# Altium project MedusaTester.PrjPcb
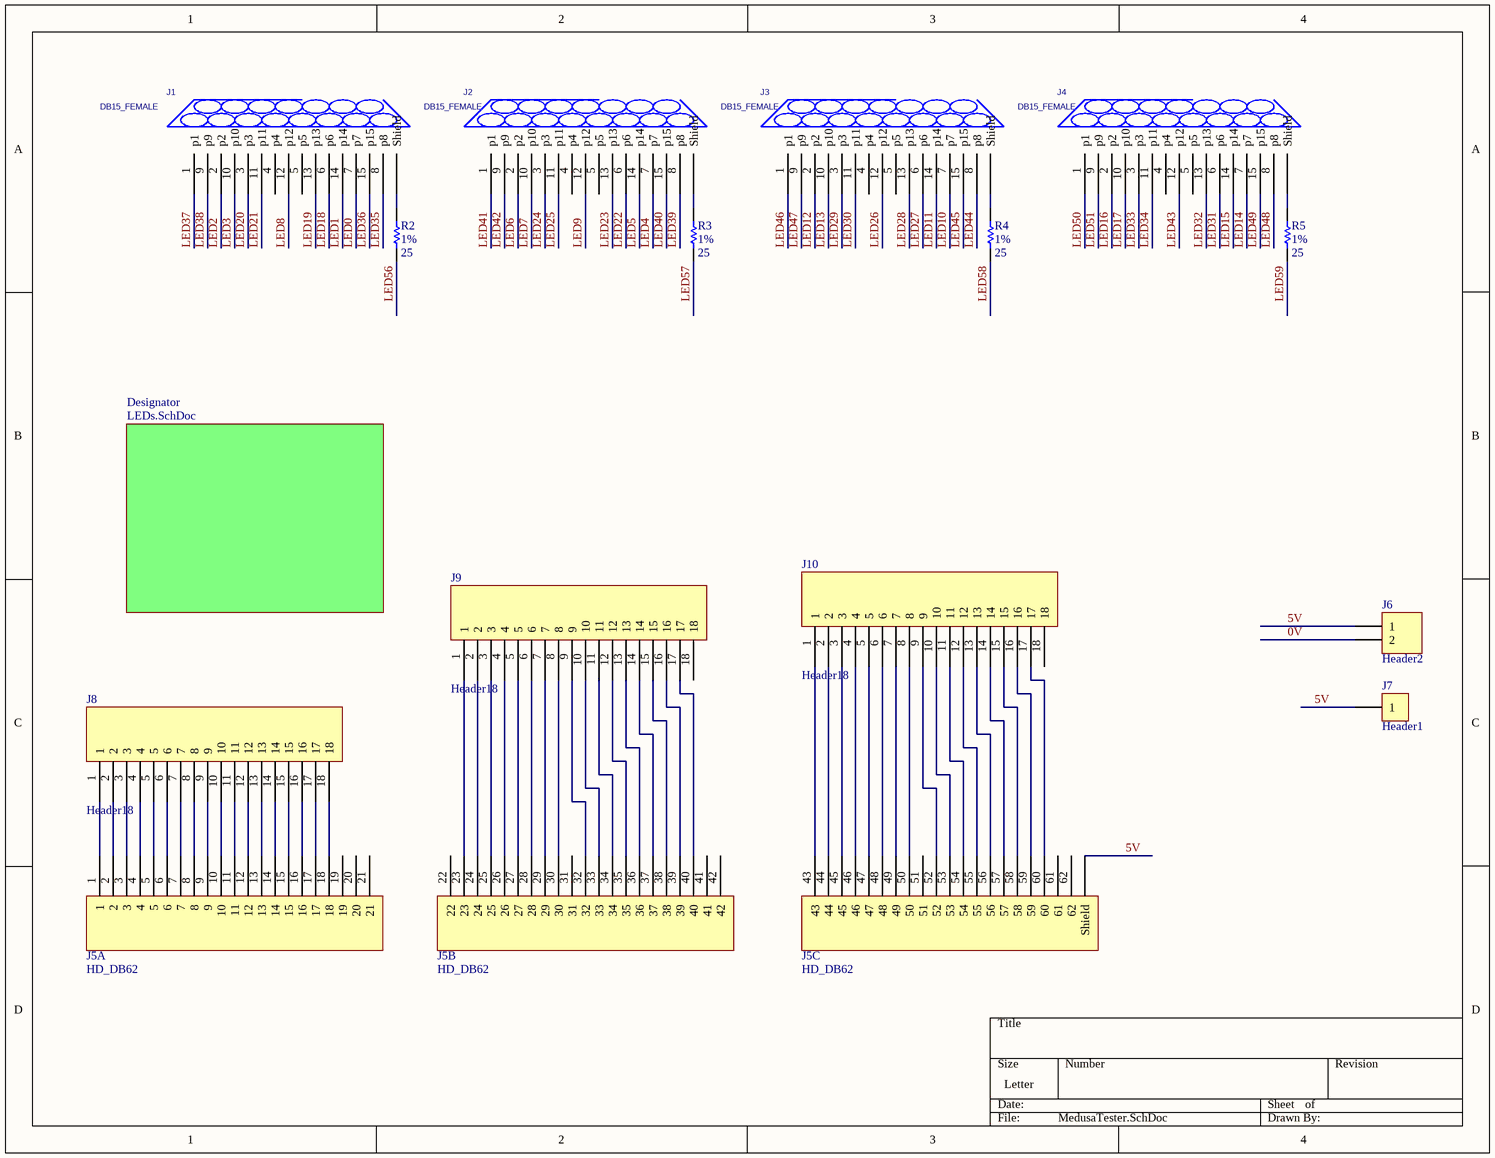
[diagram p0: MedusaTester.SchDoc]
2 sheets, 21 parts. Net scope: global (net labels, ports and power ports of the same name join across sheets).
Board file: MedusaTester.PcbDoc
Sheets:
  MedusaTester.SchDoc
    Designator = LEDs.SchDoc

## Sheet MedusaTester.SchDoc
size Letter

### Parts
J1  DB15_FEMALE  [DSUB/RS.318/TM/15]
J2  DB15_FEMALE  [DSUB/RS.318/TM/15]
J3  DB15_FEMALE  [DSUB/RS.318/TM/15]
J4  DB15_FEMALE  [DSUB/RS.318/TM/15]
J5  HD_DB62  [HD_DB62]  (parts A,B,C of 3)
J6  Header2  [HDR1X2]
J7  Header1  [HDR1]
J8  Header18  [HDR1X18]
J9  Header18  [HDR1X18]
J10  Header18  [HDR1X18]
R2  value 25  Param: 1%  [0603]  (hidden comment: 10k Ohms)
R3  value 25  Param: 1%  [0603]  (hidden comment: 10k Ohms)
R4  value 25  Param: 1%  [0603]  (hidden comment: 10k Ohms)
R5  value 25  Param: 1%  [0603]  (hidden comment: 10k Ohms)

### Sub-sheets
Designator = LEDs.SchDoc: no entries

### Nets
0V: J6.2
5V: J5.HOLE63(Shield) J6.1 J7.1
LED0: J1.7(p7)
LED1: J1.14(p14)
LED2: J1.2(p2)
LED3: J1.10(p10)
LED4: J2.7(p7)
LED5: J2.14(p14)
LED6: J2.2(p2)
LED7: J2.10(p10)
LED8: J1.12(p12)
LED9: J2.12(p12)
LED10: J3.7(p7)
LED11: J3.14(p14)
LED12: J3.2(p2)
LED13: J3.10(p10)
LED14: J4.7(p7)
LED15: J4.14(p14)
LED16: J4.2(p2)
LED17: J4.10(p10)
LED18: J1.6(p6)
LED19: J1.13(p13)
LED20: J1.3(p3)
LED21: J1.11(p11)
LED22: J2.6(p6)
LED23: J2.13(p13)
LED24: J2.3(p3)
LED25: J2.11(p11)
LED26: J3.12(p12)
LED27: J3.6(p6)
LED28: J3.13(p13)
LED29: J3.3(p3)
LED30: J3.11(p11)
LED31: J4.6(p6)
LED32: J4.13(p13)
LED33: J4.3(p3)
LED34: J4.11(p11)
LED35: J1.8(p8)
LED36: J1.15(p15)
LED37: J1.1(p1)
LED38: J1.9(p9)
LED39: J2.8(p8)
LED40: J2.15(p15)
LED41: J2.1(p1)
LED42: J2.9(p9)
LED43: J4.12(p12)
LED44: J3.8(p8)
LED45: J3.15(p15)
LED46: J3.1(p1)
LED47: J3.9(p9)
LED48: J4.8(p8)
LED49: J4.15(p15)
LED50: J4.1(p1)
LED51: J4.9(p9)
LED56: R2.1
LED57: R3.1
LED58: R4.1
LED59: R5.1
NetJ1_Hole30: J1.Hole30(Shield) R2.2
NetJ2_Hole30: J2.Hole30(Shield) R3.2
NetJ3_Hole30: J3.Hole30(Shield) R4.2
NetJ4_Hole30: J4.Hole30(Shield) R5.2
NetJ5_1: J5.1 J8.1
NetJ5_2: J5.2 J8.2
NetJ5_3: J5.3 J8.3
NetJ5_4: J5.4 J8.4
NetJ5_5: J5.5 J8.5
NetJ5_6: J5.6 J8.6
NetJ5_7: J5.7 J8.7
NetJ5_8: J5.8 J8.8
NetJ5_9: J5.9 J8.9
NetJ5_10: J5.10 J8.10
NetJ5_11: J5.11 J8.11
NetJ5_12: J5.12 J8.12
NetJ5_13: J5.13 J8.13
NetJ5_14: J5.14 J8.14
NetJ5_15: J5.15 J8.15
NetJ5_16: J5.16 J8.16
NetJ5_17: J5.17 J8.17
NetJ5_18: J5.18 J8.18
NetJ5_23: J5.23 J9.1
NetJ5_24: J5.24 J9.2
NetJ5_25: J5.25 J9.3
NetJ5_26: J5.26 J9.4
NetJ5_27: J5.27 J9.5
NetJ5_28: J5.28 J9.6
NetJ5_29: J5.29 J9.7
NetJ5_30: J5.30 J9.8
NetJ5_32: J5.32 J9.9
NetJ5_33: J5.33 J9.10
NetJ5_34: J5.34 J9.11
NetJ5_35: J5.35 J9.12
NetJ5_36: J5.36 J9.13
NetJ5_37: J5.37 J9.14
NetJ5_38: J5.38 J9.15
NetJ5_39: J5.39 J9.16
NetJ5_40: J5.40 J9.17
NetJ5_43: J5.43 J10.1
NetJ5_44: J5.44 J10.2
NetJ5_45: J5.45 J10.3
NetJ5_46: J5.46 J10.4
NetJ5_47: J5.47 J10.5
NetJ5_48: J5.48 J10.6
NetJ5_49: J5.49 J10.7
NetJ5_50: J5.50 J10.8
NetJ5_52: J5.52 J10.9
NetJ5_53: J5.53 J10.10
NetJ5_54: J5.54 J10.11
NetJ5_55: J5.55 J10.12
NetJ5_56: J5.56 J10.13
NetJ5_57: J5.57 J10.14
NetJ5_58: J5.58 J10.15
NetJ5_59: J5.59 J10.16
NetJ5_60: J5.60 J10.17

Not connected (* = marked no-connect by the designer): J1 4(p4) 5(p5); J2 4(p4) 5(p5); J3 4(p4) 5(p5); J4 4(p4) 5(p5); J5 19 20 21 22 31 41 42 51 61 62; J9 18; J10 18

### Library data of the parts
J1-J4 = DB15_FEMALE: COMPFIXED: NO; COMPGROUP: 0; COMPHEIGHT: 0.000; COMPLOC: [4502.733,1338.467]; COMPROT: 270; COMPSIDE: TOP; COMPKEY: NO; COMPLOCKED: NO; DECOUPLER: NO; MEMORY: NO
J7 = Header1: TestPoint1; Footprint: *; Techinf: *
R2-R5 = Res0603: Resistor; Param1: 100ppm/C; TechInfo: *
J6 = Header2: Footprint: *; Techinf: *

## Sheet LEDs.SchDoc
size Letter
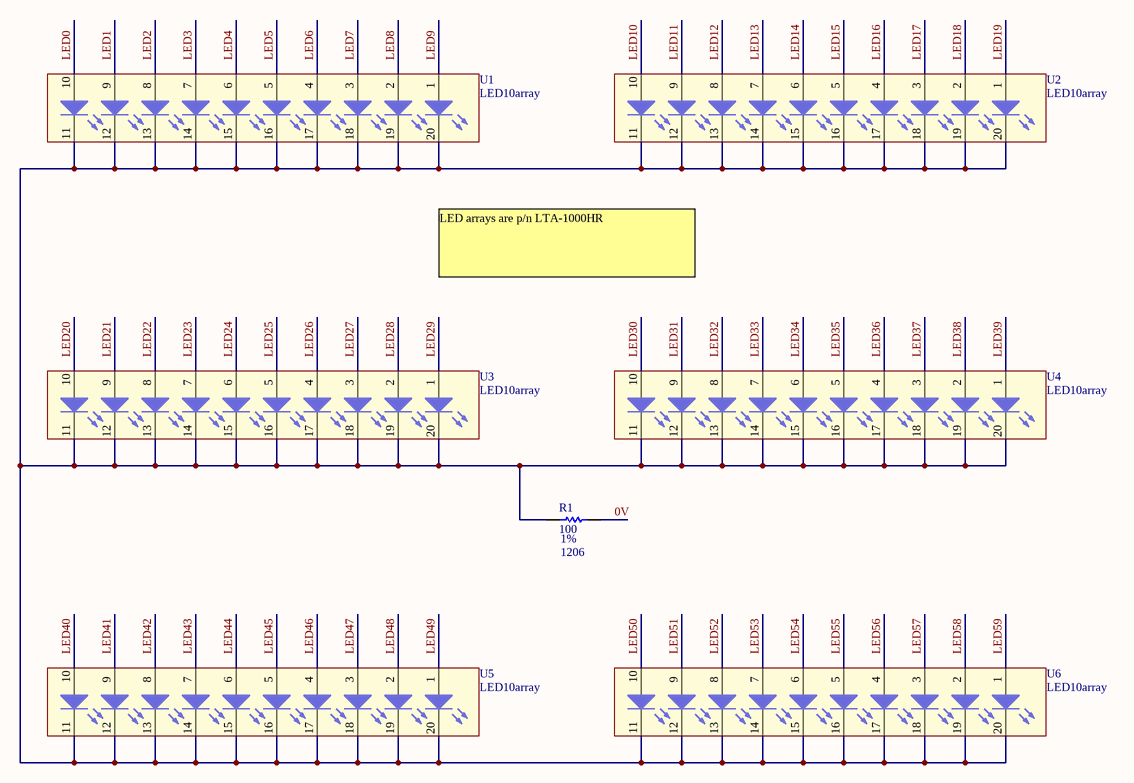
[diagram p1: LEDs.SchDoc]

### Parts
R1  100  Param: 1%  [1206]
U1  LED10array  [LED10array]
U2  LED10array  [LED10array]
U3  LED10array  [LED10array]
U4  LED10array  [LED10array]
U5  LED10array  [LED10array]
U6  LED10array  [LED10array]

### Nets
0V: R1.2
LED0: U1.10
LED1: U1.9
LED2: U1.8
LED3: U1.7
LED4: U1.6
LED5: U1.5
LED6: U1.4
LED7: U1.3
LED8: U1.2
LED9: U1.1
LED10: U2.10
LED11: U2.9
LED12: U2.8
LED13: U2.7
LED14: U2.6
LED15: U2.5
LED16: U2.4
LED17: U2.3
LED18: U2.2
LED19: U2.1
LED20: U3.10
LED21: U3.9
LED22: U3.8
LED23: U3.7
LED24: U3.6
LED25: U3.5
LED26: U3.4
LED27: U3.3
LED28: U3.2
LED29: U3.1
LED30: U4.10
LED31: U4.9
LED32: U4.8
LED33: U4.7
LED34: U4.6
LED35: U4.5
LED36: U4.4
LED37: U4.3
LED38: U4.2
LED39: U4.1
LED40: U5.10
LED41: U5.9
LED42: U5.8
LED43: U5.7
LED44: U5.6
LED45: U5.5
LED46: U5.4
LED47: U5.3
LED48: U5.2
LED49: U5.1
LED50: U6.10
LED51: U6.9
LED52: U6.8
LED53: U6.7
LED54: U6.6
LED55: U6.5
LED56: U6.4
LED57: U6.3
LED58: U6.2
LED59: U6.1
NetR1_1: R1.1 U1.11 U1.12 U1.13 U1.14 U1.15 U1.16 U1.17 U1.18 U1.19 U1.20 U2.11 U2.12 U2.13 U2.14 U2.15 U2.16 U2.17 U2.18 U2.19 U2.20 U3.11 U3.12 U3.13 U3.14 U3.15 U3.16 U3.17 U3.18 U3.19 U3.20 U4.11 U4.12 U4.13 U4.14 U4.15 U4.16 U4.17 U4.18 U4.19 U4.20 U5.11 U5.12 U5.13 U5.14 U5.15 U5.16 U5.17 U5.18 U5.19 U5.20 U6.11 U6.12 U6.13 U6.14 U6.15 U6.16 U6.17 U6.18 U6.19 U6.20

### Notes on the sheet
- LED arrays are p/n LTA-1000HR

### Library data of the parts
R1 = Res1206: Resistor; Param1: 100ppm/C; Value: DNL; TechInfo: *

## Nets that join several sheets
0V: MedusaTester (J6.2), LEDs (R1.2)
LED0: MedusaTester (J1.7), LEDs (U1.10)
LED1: MedusaTester (J1.14), LEDs (U1.9)
LED2: MedusaTester (J1.2), LEDs (U1.8)
LED3: MedusaTester (J1.10), LEDs (U1.7)
LED4: MedusaTester (J2.7), LEDs (U1.6)
LED5: MedusaTester (J2.14), LEDs (U1.5)
LED6: MedusaTester (J2.2), LEDs (U1.4)
LED7: MedusaTester (J2.10), LEDs (U1.3)
LED8: MedusaTester (J1.12), LEDs (U1.2)
LED9: MedusaTester (J2.12), LEDs (U1.1)
LED10: MedusaTester (J3.7), LEDs (U2.10)
LED11: MedusaTester (J3.14), LEDs (U2.9)
LED12: MedusaTester (J3.2), LEDs (U2.8)
LED13: MedusaTester (J3.10), LEDs (U2.7)
LED14: MedusaTester (J4.7), LEDs (U2.6)
LED15: MedusaTester (J4.14), LEDs (U2.5)
LED16: MedusaTester (J4.2), LEDs (U2.4)
LED17: MedusaTester (J4.10), LEDs (U2.3)
LED18: MedusaTester (J1.6), LEDs (U2.2)
LED19: MedusaTester (J1.13), LEDs (U2.1)
LED20: MedusaTester (J1.3), LEDs (U3.10)
LED21: MedusaTester (J1.11), LEDs (U3.9)
LED22: MedusaTester (J2.6), LEDs (U3.8)
LED23: MedusaTester (J2.13), LEDs (U3.7)
LED24: MedusaTester (J2.3), LEDs (U3.6)
LED25: MedusaTester (J2.11), LEDs (U3.5)
LED26: MedusaTester (J3.12), LEDs (U3.4)
LED27: MedusaTester (J3.6), LEDs (U3.3)
LED28: MedusaTester (J3.13), LEDs (U3.2)
LED29: MedusaTester (J3.3), LEDs (U3.1)
LED30: MedusaTester (J3.11), LEDs (U4.10)
LED31: MedusaTester (J4.6), LEDs (U4.9)
LED32: MedusaTester (J4.13), LEDs (U4.8)
LED33: MedusaTester (J4.3), LEDs (U4.7)
LED34: MedusaTester (J4.11), LEDs (U4.6)
LED35: MedusaTester (J1.8), LEDs (U4.5)
LED36: MedusaTester (J1.15), LEDs (U4.4)
LED37: MedusaTester (J1.1), LEDs (U4.3)
LED38: MedusaTester (J1.9), LEDs (U4.2)
LED39: MedusaTester (J2.8), LEDs (U4.1)
LED40: MedusaTester (J2.15), LEDs (U5.10)
LED41: MedusaTester (J2.1), LEDs (U5.9)
LED42: MedusaTester (J2.9), LEDs (U5.8)
LED43: MedusaTester (J4.12), LEDs (U5.7)
LED44: MedusaTester (J3.8), LEDs (U5.6)
LED45: MedusaTester (J3.15), LEDs (U5.5)
LED46: MedusaTester (J3.1), LEDs (U5.4)
LED47: MedusaTester (J3.9), LEDs (U5.3)
LED48: MedusaTester (J4.8), LEDs (U5.2)
LED49: MedusaTester (J4.15), LEDs (U5.1)
LED50: MedusaTester (J4.1), LEDs (U6.10)
LED51: MedusaTester (J4.9), LEDs (U6.9)
LED56: MedusaTester (R2.1), LEDs (U6.4)
LED57: MedusaTester (R3.1), LEDs (U6.3)
LED58: MedusaTester (R4.1), LEDs (U6.2)
LED59: MedusaTester (R5.1), LEDs (U6.1)